# EAGLE schematic a124-vca (EAGLE 7.6.0)
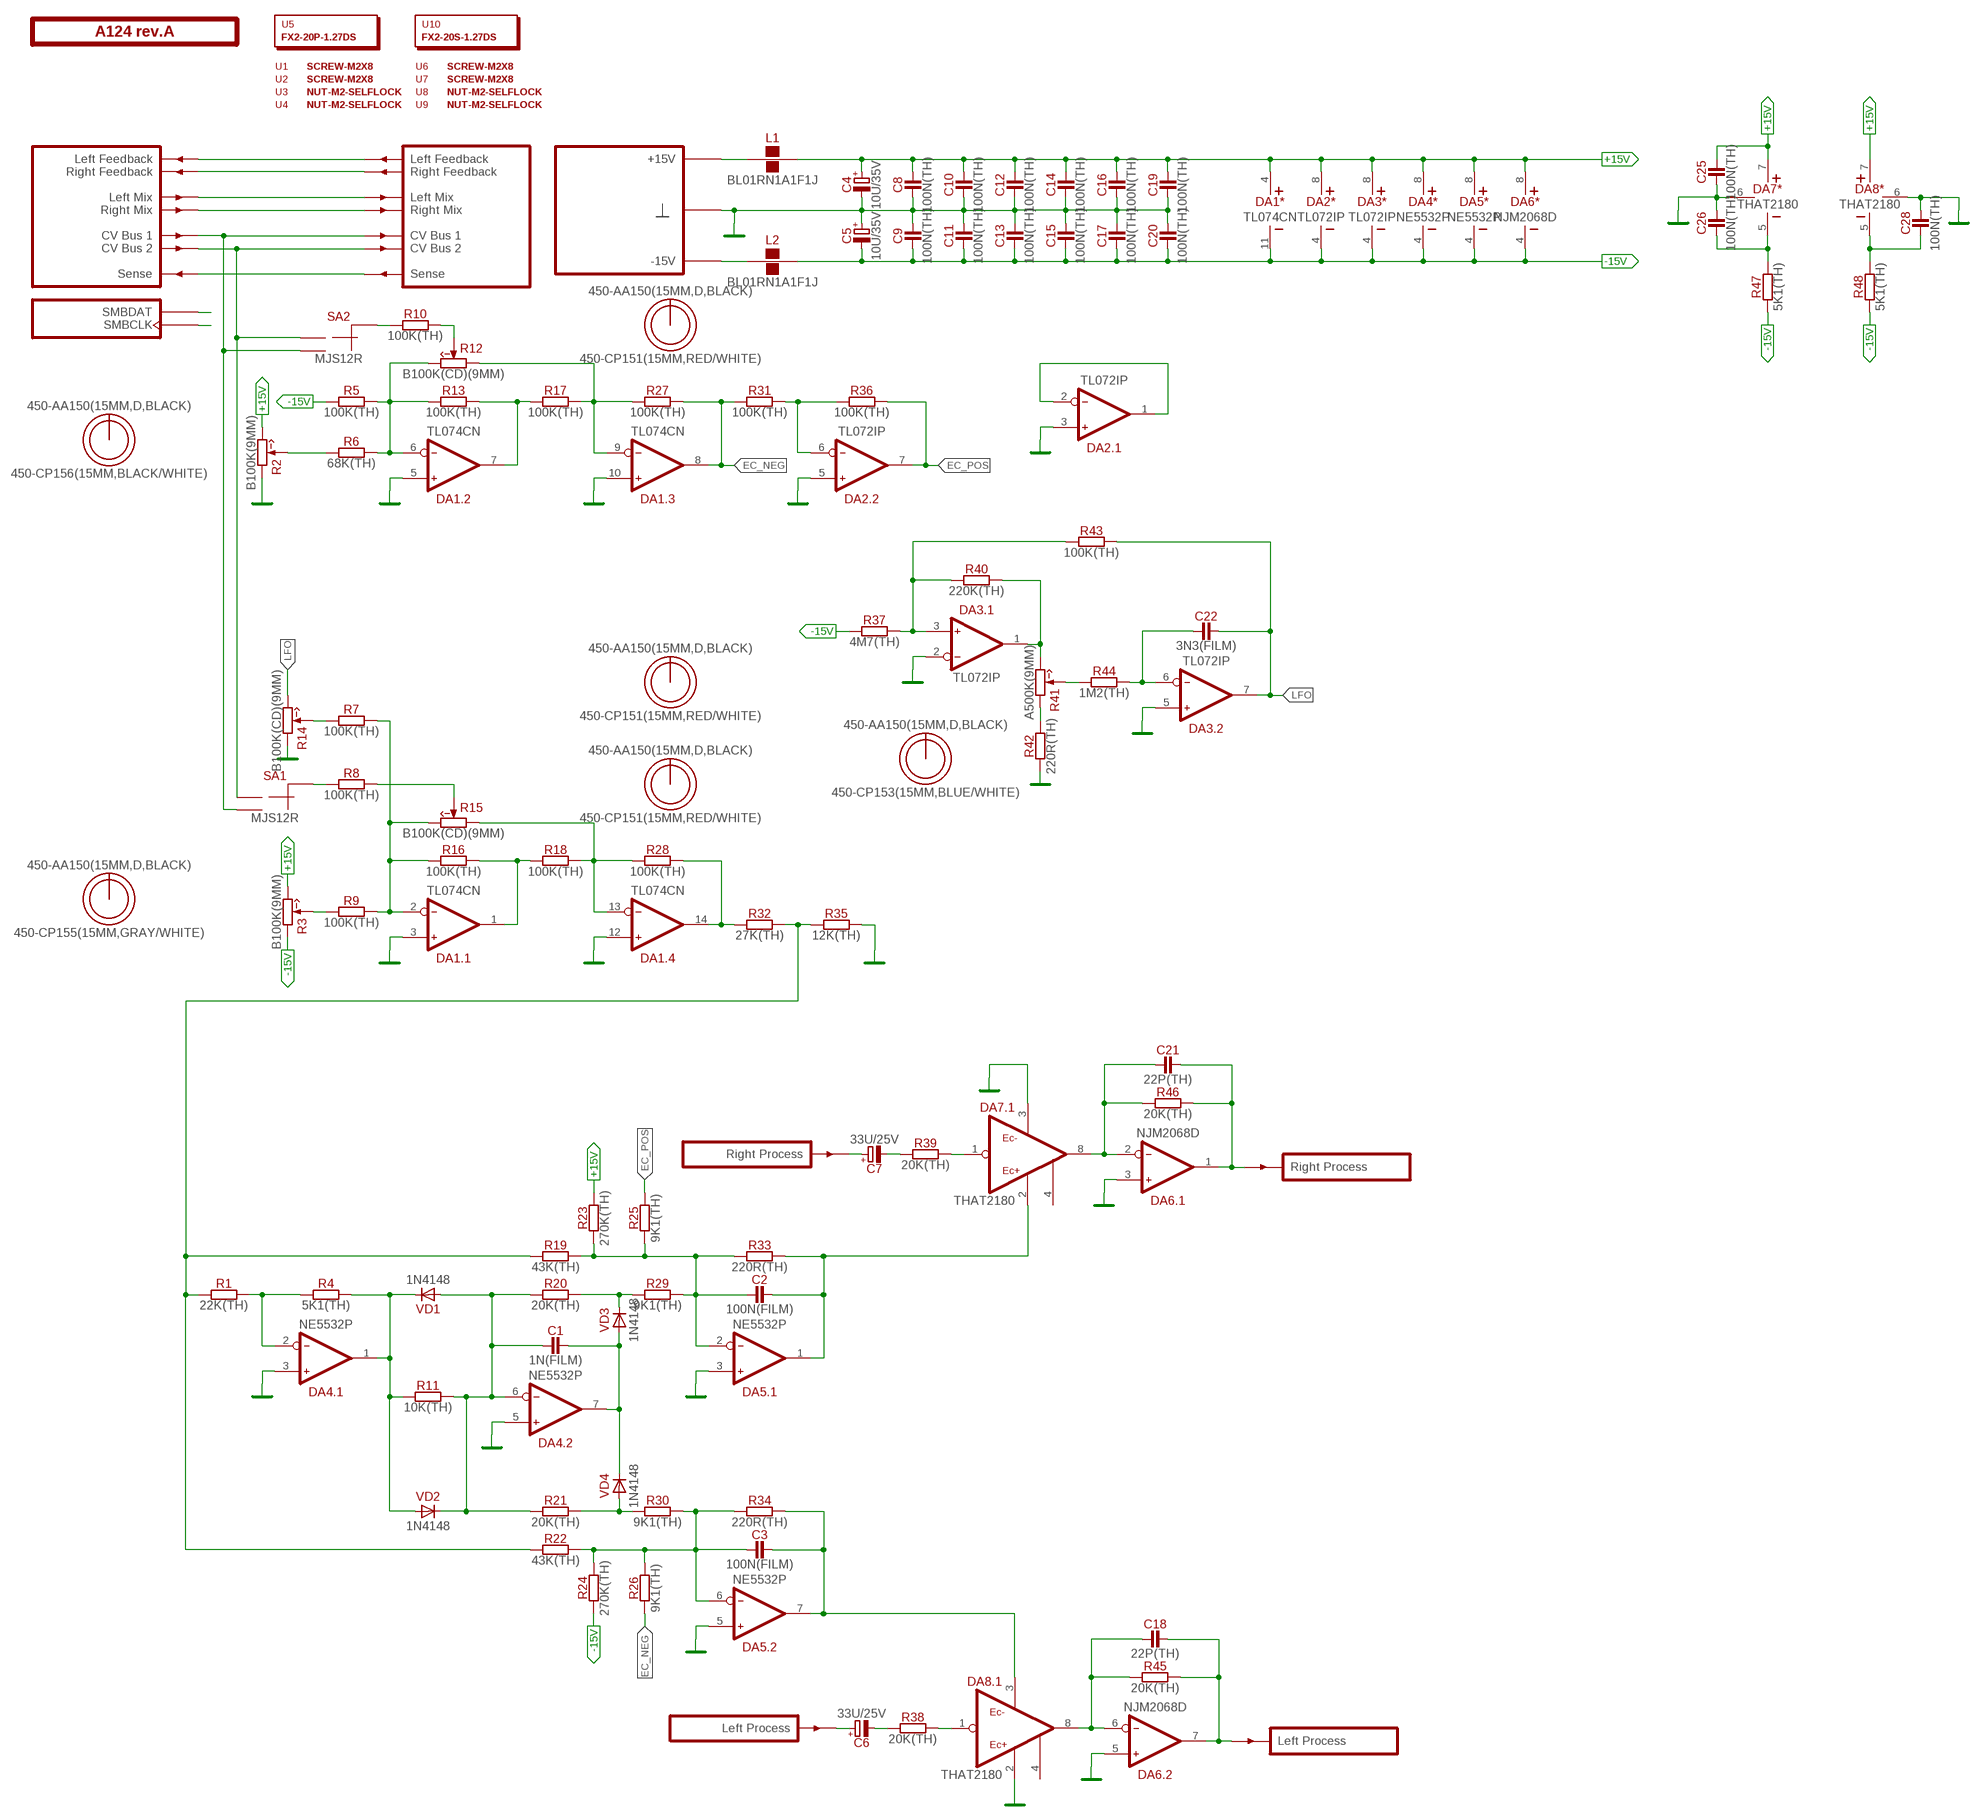
[diagram p0: schematic, sheet 1]

## Parts
C1  1N(FILM)  [C050-025X075]
C2  100N(FILM)  [C050-025X075]
C3  100N(FILM)  [C050-025X075]
C4  10U/35V  [E2-5]
C5  10U/35V  [E2-5]
C6  33U/25V  [E2,5-7]
C7  33U/25V  [E2,5-7]
C8  100N(TH)  [C050-024X044]
C9  100N(TH)  [C050-024X044]
C10  100N(TH)  [C050-024X044]
C11  100N(TH)  [C050-024X044]
C12  100N(TH)  [C050-024X044]
C13  100N(TH)  [C050-024X044]
C14  100N(TH)  [C050-024X044]
C15  100N(TH)  [C050-024X044]
C16  100N(TH)  [C050-024X044]
C17  100N(TH)  [C050-024X044]
C18  22P(TH)  [C050-024X044]
C19  100N(TH)  [C050-024X044]
C20  100N(TH)  [C050-024X044]
C21  22P(TH)  [C050-024X044]
C22  3N3(FILM)  [C050-025X075]
C25  100N(TH)  [C050-024X044]
C26  100N(TH)  [C050-024X044]
C28  100N(TH)  [C050-024X044]
DA1  TL074CN  [DIP-14]
DA2  TL072IP  [DIP-8]
DA3  TL072IP  [DIP-8]
DA4  NE5532P  [DIP-8]
DA5  NE5532P  [DIP-8]
DA6  NJM2068D  [DIP-8]
DA7  THAT2180  [SIL8]
DA8  THAT2180  [SIL8]
L1  BL01RN1A1F1J  [BL01RN1A]
L2  BL01RN1A1F1J  [BL01RN1A]
O1  450-AA150(15MM,D,BLACK)  [EMPTY]
O2  450-CP156(15MM,BLACK/WHITE)  [EMPTY]
O3  450-AA150(15MM,D,BLACK)  [EMPTY]
O4  450-CP155(15MM,GRAY/WHITE)  [EMPTY]
O5  450-AA150(15MM,D,BLACK)  [EMPTY]
O6  450-CP151(15MM,RED/WHITE)  [EMPTY]
O7  450-AA150(15MM,D,BLACK)  [EMPTY]
O8  450-CP151(15MM,RED/WHITE)  [EMPTY]
O9  450-AA150(15MM,D,BLACK)  [EMPTY]
O10  450-CP151(15MM,RED/WHITE)  [EMPTY]
O11  450-AA150(15MM,D,BLACK)  [EMPTY]
O12  450-CP153(15MM,BLUE/WHITE)  [EMPTY]
PCB1  A124 rev.A  ST2-BOARD-74  [ST2-BOARD-74]
R1  22K(TH)  [R-0207/10]
R2  B100K(9MM)  [RV09-SINGLE]
R3  B100K(9MM)  [RV09-SINGLE]
R4  5K1(TH)  [R-0207/10]
R5  100K(TH)  [R-0207/10]
R6  68K(TH)  [R-0207/10]
R7  100K(TH)  [R-0207/10]
R8  100K(TH)  [R-0207/10]
R9  100K(TH)  [R-0207/10]
R10  100K(TH)  [R-0207/10]
R11  10K(TH)  [R-0207/10]
R12  B100K(CD)(9MM)  [RV09-SINGLE]
R13  100K(TH)  [R-0207/10]
R14  B100K(CD)(9MM)  [RV09-SINGLE]
R15  B100K(CD)(9MM)  [RV09-SINGLE]
R16  100K(TH)  [R-0207/10]
R17  100K(TH)  [R-0207/10]
R18  100K(TH)  [R-0207/10]
R19  43K(TH)  [R-0207/10]
R20  20K(TH)  [R-0207/10]
R21  20K(TH)  [R-0207/10]
R22  43K(TH)  [R-0207/10]
R23  270K(TH)  [R-0207/10]
R24  270K(TH)  [R-0207/10]
R25  9K1(TH)  [R-0207/10]
R26  9K1(TH)  [R-0207/10]
R27  100K(TH)  [R-0207/10]
R28  100K(TH)  [R-0207/10]
R29  9K1(TH)  [R-0207/10]
R30  9K1(TH)  [R-0207/10]
R31  100K(TH)  [R-0207/10]
R32  27K(TH)  [R-0207/10]
R33  220R(TH)  [R-0207/10]
R34  220R(TH)  [R-0207/10]
R35  12K(TH)  [R-0207/10]
R36  100K(TH)  [R-0207/10]
R37  4M7(TH)  [R-0207/10]
R38  20K(TH)  [R-0207/10]
R39  20K(TH)  [R-0207/10]
R40  220K(TH)  [R-0207/10]
R41  A500K(9MM)  [RV09-SINGLE]
R42  220R(TH)  [R-0207/10]
R43  100K(TH)  [R-0207/10]
R44  1M2(TH)  [R-0207/10]
R45  20K(TH)  [R-0207/10]
R46  20K(TH)  [R-0207/10]
R47  5K1(TH)  [R-0207/10]
R48  5K1(TH)  [R-0207/10]
SA1  MJS12R  [APEM-MJS12R]
SA2  MJS12R  [APEM-MJS12R]
U1  SCREW-M2X8  [EMPTY]
U2  SCREW-M2X8  [EMPTY]
U3  NUT-M2-SELFLOCK  [EMPTY]
U4  NUT-M2-SELFLOCK  [EMPTY]
U5  FX2-20P-1.27DS  [EMPTY]
U6  SCREW-M2X8  [EMPTY]
U7  SCREW-M2X8  [EMPTY]
U8  NUT-M2-SELFLOCK  [EMPTY]
U9  NUT-M2-SELFLOCK  [EMPTY]
U10  FX2-20S-1.27DS  [EMPTY]
VD1  1N4148  [DO35-7]
VD2  1N4148  [DO35-7]
VD3  1N4148  [DO35-7]
VD4  1N4148  [DO35-7]

## Nets
+15V: C4.+ C8.2 C10.2 C12.2 C14.2 C16.2 C19.2 C25.2 DA1.4(*:V+) DA2.8(*:V+) DA3.8(*:V+) DA4.8(*:V+) DA5.8(*:V+) DA6.8(*:V+) DA7.7(*:V+) DA8.7(*:V+) L1.2 R2.3(CW) R3.3(CW) R23.2
-15V: C5.- C9.1 C11.1 C13.1 C15.1 C17.1 C20.1 DA1.11(*:V-) DA2.4(*:V-) DA3.4(*:V-) DA4.4(*:V-) DA5.4(*:V-) DA6.4(*:V-) L2.2 R3.1(CCW) R5.1 R24.1 R37.1 R47.1 R48.1
EC_NEG: DA1.8(.3:OUT) R26.1 R27.2 R31.1
EC_POS: DA2.7(.2:OUT) R25.2 R36.2
GND: C4.- C5.+ C8.1 C9.2 C10.1 C11.2 C12.1 C13.2 C14.1 C15.2 C16.1 C17.2 C19.1 C20.2 C25.1 C26.2 C28.2 DA1.3(.1:IN+) DA1.5(.2:IN+) DA1.10(.3:IN+) DA1.12(.4:IN+) DA2.3(.1:IN+) DA2.5(.2:IN+) DA3.2(.1:IN-) DA3.5(.2:IN+) DA4.3(.1:IN+) DA4.5(.2:IN+) DA5.3(.1:IN+) DA5.5(.2:IN+) DA6.3(.1:IN+) DA6.5(.2:IN+) DA7.3(.1:EC-) DA7.6(*:GND) DA8.2(.1:EC+) DA8.6(*:GND) PCB1.B4'(GND) PCB1.B4(GND) PCB1.B5'(GND) PCB1.B5(GND) PCB1.B6'(GND) PCB1.B6(GND) PCB1.B7'(GND) PCB1.B7(GND) PCB1.B8'(GND) PCB1.B8(GND) R2.1(CCW) R14.1(CCW) R35.2 R42.1
LFO: C22.2 DA3.7(.2:OUT) R14.3(CW) R43.2
LMIX: PCB1.ALMIX'(LMIX') PCB1.ALMIX(LMIX)
N$1: L1.1 PCB1.A+15'(P+15V) PCB1.A+15(P+15V) PCB1.B+15'(P+15V) PCB1.B+15(P+15V)
N$2: PCB1.ALFBK'(LFBK') PCB1.ALFBK(LFBK)
N$3: R10.2 R12.2(W)
N$4: PCB1.ARFBK'(RFBK') PCB1.ARFBK(RFBK)
N$5: DA1.6(.2:IN-) R5.2 R6.2 R12.3(CW) R13.1
N$6: DA1.7(.2:OUT) R13.2 R17.1
N$7: DA1.9(.3:IN-) R12.1(CCW) R17.2 R27.1
N$8: DA4.2(.1:IN-) R1.2 R4.1
N$9: R10.1 SA2.C(CM)
N$10: R8.2 R15.2(W)
N$11: DA1.2(.1:IN-) R7.2 R9.2 R15.3(CW) R16.1
N$12: DA1.1(.1:OUT) R16.2 R18.1
N$13: R2.2(W) R6.1
N$14: DA1.13(.4:IN-) R15.1(CCW) R18.2 R28.1
N$15: DA4.1(.1:OUT) R4.2 R11.1 VD1.C VD2.A
N$16: PCB1.BSENSE'(SENSE') PCB1.BSENSE(SENSE)
N$17: R8.1 SA1.C(CM)
N$18: PCB1.ACV1'(CV1') PCB1.ACV1(CV1) SA1.NO SA2.NO
N$19: R3.2(W) R9.1
N$20: DA1.14(.4:OUT) R28.2 R32.1
N$21: DA2.6(.2:IN-) R31.2 R36.1
N$22: C1.2 DA4.7(.2:OUT) VD3.A VD4.C
N$23: R20.2 R29.1 VD3.C
N$24: C1.1 DA4.6(.2:IN-) R11.2 R20.1 R21.1 VD1.A VD2.C
N$25: L2.1 PCB1.A-15'(P-15V) PCB1.A-15(P-15V) PCB1.B-15'(P-15V) PCB1.B-15(P-15V)
N$26: R21.2 R30.1 VD4.A
N$27: C2.2 DA5.1(.1:OUT) DA7.2(.1:EC+) R33.2
N$28: DA3.1(.1:OUT) R40.2 R41.3(CW)
N$29: R41.1(CCW) R42.2
N$30: C3.2 DA5.7(.2:OUT) DA8.3(.1:EC-) R34.2
N$31: C3.1 DA5.6(.2:IN-) R22.2 R24.2 R26.2 R30.2 R34.1
N$32: C2.1 DA5.2(.1:IN-) R19.2 R23.1 R25.1 R29.2 R33.1
N$33: R41.2(W) R44.1
N$34: C22.1 DA3.6(.2:IN-) R44.2
N$35: C26.1 DA7.5(*:V-) R47.2
N$36: R7.1 R14.2(W)
N$37: C28.1 DA8.5(*:V-) R48.2
N$38: PCB1.ASMBDAT'(SMBDAT) PCB1.ASMBDAT(SMBDAT)
N$39: DA3.3(.1:IN+) R37.2 R40.1 R43.1
N$40: DA2.1(.1:OUT) DA2.2(.1:IN-)
N$41: C18.1 DA6.6(.2:IN-) DA8.8(.1:OUT) R45.1
N$42: PCB1.ACV2'(CV2') PCB1.ACV2(CV2) SA1.NC SA2.NC
N$43: PCB1.ASMBCLK'(SMBCLK) PCB1.ASMBCLK(SMBCLK)
N$44: C18.2 DA6.7(.2:OUT) PCB1.BOUTL'(OUTL) R45.2
N$45: C21.1 DA6.2(.1:IN-) DA7.8(.1:OUT) R46.1
N$46: C21.2 DA6.1(.1:OUT) PCB1.BOUTR'(OUTR) R46.2
N$47: C6.- R38.1
N$48: DA8.1(.1:IN-) R38.2
N$49: DA7.1(.1:IN-) R39.2
N$50: C7.- R39.1
N$53: C7.+ PCB1.BINR(INR)
N$54: C6.+ PCB1.BINL(INL)
N$56: R1.1 R19.1 R22.1 R32.2 R35.1
RMIX: PCB1.ARMIX'(RMIX') PCB1.ARMIX(RMIX)
Unconnected: DA7.4(.1:SYM) DA8.4(.1:SYM)

## Library data of the parts
C1 C18 C21 = capacitors:?
C2 C3 = capacitors:?; MOUSER: 505-MKS2.1/63/5
C4 C5 = capacitors-electrolytic:?; MOUSER: 647-USW1V100MDD
C6 C7 = capacitors-electrolytic:?
C8-C17 C19 C20 C25 C26 C28 = capacitors:?; MOUSER: 81-RCER71H104K0A2H3B
C22 = capacitors:?; MOUSER: 505-FKS23300/100/10
DA1 = ic-ti:TL074
DA2 DA3 = ic-ti:TL072; MOUSER: 595-TL072IP
DA4 DA5 = ic-ti:NE5532; MOUSER: 595-SA5532AP
DA6 = ic-jrc:NJM2068; MOUSER: 513-NJM2068D
DA7 DA8 = ic-that:THAT2180
L1 L2 = inductors:BL01RN1A?; MOUSER: 81-BL01RN1A1F1J
O1 O3 O5 O7 O9 O11 = hardware:450-AA?; MOUSER: 450-AA150
O2 = hardware:450-C?; MOUSER: 450-CP156
O4 = hardware:450-C?; MOUSER: 450-CP155
O6 O8 O10 = hardware:450-C?
O12 = hardware:450-C?; MOUSER: 450-CP153
PCB1 = module-footprints:ST2-BOARD-?
R1 = resistors:?; MOUSER: 71-CCF0722K0GKE36
R2 R3 = potentiometers:?; MOUSER: 688-RK09D113BF25B15
R4 R6 R19-R26 R29 R30 R32-R35 R37-R40 R42 R44-R48 = resistors:?
R5 R7-R10 R13 R16-R18 R27 R28 R31 R36 R43 = resistors:?; MOUSER: 71-RN55D-F-100K
R11 = resistors:?; MOUSER: 71-RN55D-F-10K
R12 R14 R15 = potentiometers:?; MOUSER: 652-PTV09A-4225FB104
R41 = potentiometers:?; MOUSER: 688-RK09D113AF25A55
SA1 SA2 = switches:MJS12R; MOUSER: 642-MJS12R
U1-U4 U6-U9 = hardware:*?
U5 = hardware:?; MOUSER: 798-FX2-20P-1.27DS71
U10 = hardware:?; MOUSER: 798-FX2-20S-1.27DS71
VD1-VD4 = diodes:?; MOUSER: 583-1N4148-T